# EAGLE schematic AAA_source-all_on_top (EAGLE 7.2.0)
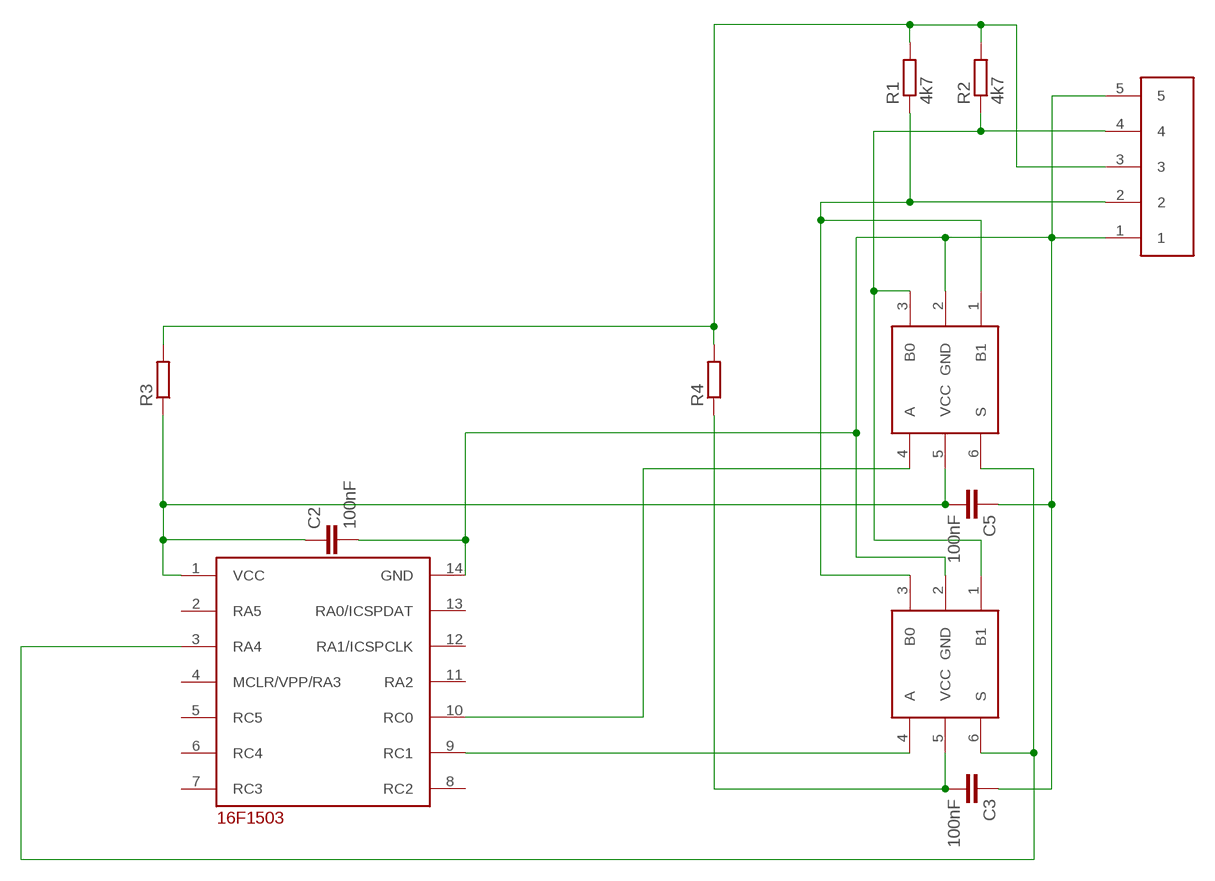
[diagram p0: schematic, sheet 1]

## Parts
C2  100nF  C-EUC0603  [C0603]
C3  100nF  C-EUC0603  [C0603]
C5  100nF  C-EUC0603  [C0603]
R1  4k7  R-EU_R0603  [R0603]
R2  4k7  R-EU_R0603  [R0603]
R3  R-EU_R1206  [R1206]
R4  R-EU_R1206  [R1206]
U$1  16F103-TSSOP  [TSSOP14]
U$5  JUMPER5F-90  [JUMPER5F-90]
U$6  NC7SB3157P6X  [SC70-6L]
U$7  NC7SB3157P6X  [SC70-6L]

## Nets
GND: C2.2 C3.1 C5.1 U$1.14(GND) U$5.1 U$5.5 U$6.2(GND) U$7.2(GND)
N$1: U$1.3(RA4) U$6.6(S) U$7.6(S)
N$2: C2.1 C5.2 R3.1 U$1.1(VCC) U$6.5(VCC)
N$3: C3.2 R4.1 U$7.5(VCC)
N$4: U$1.9(RC1) U$7.4(A)
N$6: R1.1 U$5.2 U$6.1(B1) U$7.3(B0)
N$7: U$1.10(RC0) U$6.4(A)
N$10: R2.1 U$5.4 U$6.3(B0) U$7.1(B1)
VCC: R1.2 R2.2 R3.2 R4.2 U$5.3
Unconnected: U$1.2(RA5) U$1.4(MCLR/VPP/RA3) U$1.5(RC5) U$1.6(RC4) U$1.7(RC3) U$1.8(RC2) U$1.11(RA2) U$1.12(RA1/ICSPCLK) U$1.13(RA0/ICSPDAT)

## Library data of the parts
C2 C3 C5 = resistor:C-EU: CAPACITOR, European symbol
R1-R4 = resistor:R-EU_: RESISTOR, European symbol
U$1 = !stavebnice03:16F103-TSSOP
U$5 = !stavebnice03:JUMPER5F-90
U$6 U$7 = !stavebnice03:NC7SB3157P6X